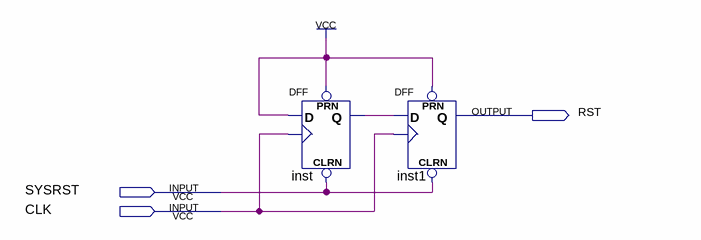
[diagram p0: schematic sheet]
// Quartus schematic Synchronizer.bdf as structural Verilog: 2 symbols, 3 pins
module Synchronizer (
  input  SYSRST,
  input  CLK,
  output RST
);

  wire inst_q;

  DFF inst (.CLRN(SYSRST), .CLK(CLK), .D(1'b1), .PRN(1'b1), .Q(inst_q));
  DFF inst1 (.CLRN(SYSRST), .CLK(CLK), .D(inst_q), .PRN(1'b1), .Q(RST));
endmodule
